# Altium schematic sheet Project overview.SchDoc
size A4; SheetNumber: 1; SheetTotal: 10
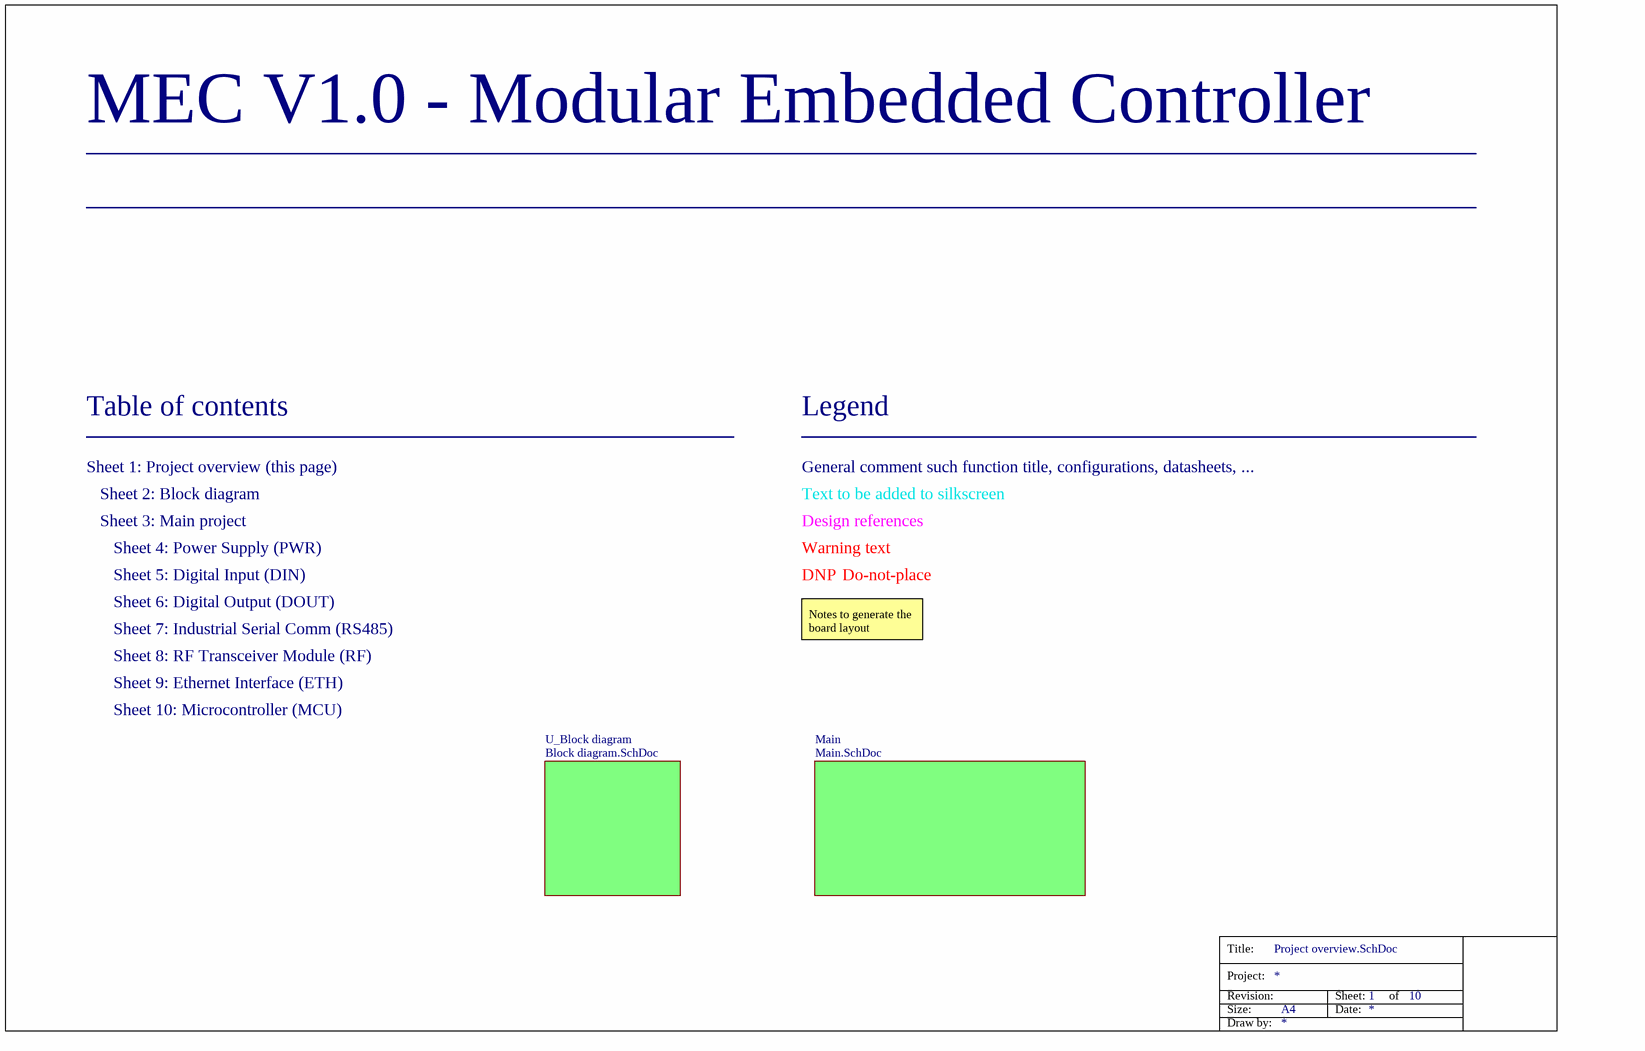
[diagram p0: Project overview.SchDoc]

## Sub-sheets
Main = Main.SchDoc: no entries
U_Block diagram = Block diagram.SchDoc: no entries

## Notes on the sheet
- MEC V1.0 - Modular Embedded Controller
- Table of contents
- Legend
- Sheet 1: Project overview (this page)
- Sheet 2: Block diagram
- General comment such function title, configurations, datasheets, ...
- Text to be added to silkscreen
- Sheet 3: Main project
- Sheet 5: Digital Input (DIN)
- Sheet 4: Power Supply (PWR)
- Warning text
- DNP
- Design references
- Do-not-place
- Sheet 6: Digital Output (DOUT)
- Sheet 7: Industrial Serial Comm (RS485)
- Notes to generate the board layout
- Sheet 8: RF Transceiver Module (RF)
- Sheet 10: Microcontroller (MCU)
- Sheet 9: Ethernet Interface (ETH)
- Title:
- Project:
- Revision:
- Size:
- Draw by:
- A4
- Sheet:
- Date:
- of